# Altium schematic sheet ECU_Dummy.SchDoc
size A4; SheetNumber: 1; SheetTotal: 1
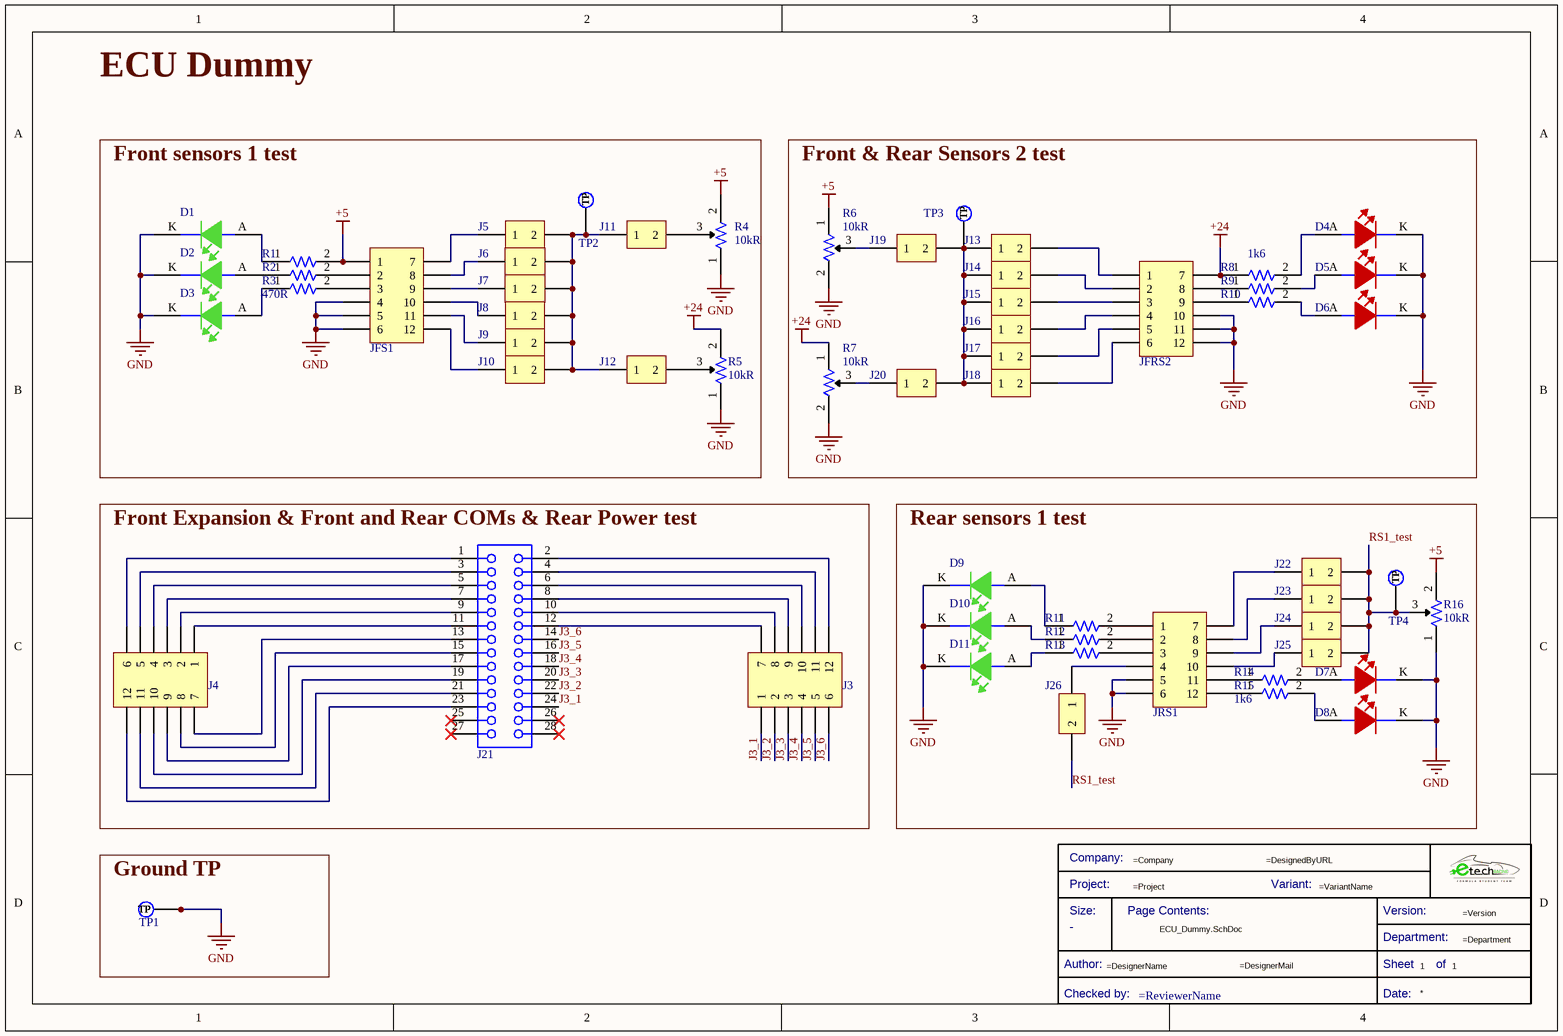
[diagram p0: ECU_Dummy.SchDoc]

## Parts
*  Title Block_template  (value not drawn)  (graphical)
D1  150080GS75000  [LED_0805_WE]  (value not drawn)
D2  150080GS75000  [LED_0805_WE]  (value not drawn)
D3  150080GS75000  [LED_0805_WE]  (value not drawn)
D4  150080RS75000  [LED_0805_WE]  (value not drawn)
D5  150080RS75000  [LED_0805_WE]  (value not drawn)
D6  150080RS75000  [LED_0805_WE]  (value not drawn)
D7  150080RS75000  [LED_0805_WE]  (value not drawn)
D8  150080RS75000  [LED_0805_WE]  (value not drawn)
D9  150080GS75000  [LED_0805_WE]  (value not drawn)
D10  150080GS75000  [LED_0805_WE]  (value not drawn)
D11  150080GS75000  [LED_0805_WE]  (value not drawn)
J3  1053101112  [J_NanoFit_2x6_V]  (value not drawn)
J4  1053101112  [J_NanoFit_2x6_V]  (value not drawn)
J5  2 Pin Header  [J_Pinheader_1x2]  (value not drawn)
J6  2 Pin Header  [J_Pinheader_1x2]  (value not drawn)
J7  2 Pin Header  [J_Pinheader_1x2]  (value not drawn)
J8  2 Pin Header  [J_Pinheader_1x2]  (value not drawn)
J9  2 Pin Header  [J_Pinheader_1x2]  (value not drawn)
J10  2 Pin Header  [J_Pinheader_1x2]  (value not drawn)
J11  2 Pin Header  [J_Pinheader_1x2]  (value not drawn)
J12  2 Pin Header  [J_Pinheader_1x2]  (value not drawn)
J13  2 Pin Header  [J_Pinheader_1x2]  (value not drawn)
J14  2 Pin Header  [J_Pinheader_1x2]  (value not drawn)
J15  2 Pin Header  [J_Pinheader_1x2]  (value not drawn)
J16  2 Pin Header  [J_Pinheader_1x2]  (value not drawn)
J17  2 Pin Header  [J_Pinheader_1x2]  (value not drawn)
J18  2 Pin Header  [J_Pinheader_1x2]  (value not drawn)
J19  2 Pin Header  [J_Pinheader_1x2]  (value not drawn)
J20  2 Pin Header  [J_Pinheader_1x2]  (value not drawn)
J21  61002821821  [61002821821]  (value not drawn)
J22  2 Pin Header  [J_Pinheader_1x2]  (value not drawn)
J23  2 Pin Header  [J_Pinheader_1x2]  (value not drawn)
J24  2 Pin Header  [J_Pinheader_1x2]  (value not drawn)
J25  2 Pin Header  [J_Pinheader_1x2]  (value not drawn)
J26  2 Pin Header  [J_Pinheader_1x2]  (value not drawn)
JFRS2  1053101112  [J_NanoFit_2x6_V]  (value not drawn)
JFS1  1053101112  [J_NanoFit_2x6_V]  (value not drawn)
JRS1  1053101112  [J_NanoFit_2x6_V]  (value not drawn)
R1  CR0805-FX-4700GLF  [R0805FTK]  (value not drawn)
R2  CR0805-FX-4700GLF  [R0805FTK]  (value not drawn)
R3  CR0805-FX-4700GLF  [R0805FTK]  (value not drawn)
R4  Resistance: 10kR  [R10k-VTR]  (hidden comment: 3296W-1-103LF)
R5  Resistance: 10kR  [R10k-VTR]  (hidden comment: 3296W-1-103LF)
R6  Resistance: 10kR  [R10k-VTR]  (hidden comment: 3296W-1-103LF)
R7  Resistance: 10kR  [R10k-VTR]  (hidden comment: 3296W-1-103LF)
R8  CR1206-FX-2201ELF  [R1206FTK-W]  (value not drawn)
R9  CR1206-FX-2201ELF  [R1206FTK-W]  (value not drawn)
R10  CR1206-FX-2201ELF  [R1206FTK-W]  (value not drawn)
R11  CR0805-FX-4700GLF  [R0805FTK]  (value not drawn)
R12  CR0805-FX-4700GLF  [R0805FTK]  (value not drawn)
R13  CR0805-FX-4700GLF  [R0805FTK]  (value not drawn)
R14  CR1206-FX-2201ELF  [R1206FTK-W]  (value not drawn)
R15  CR1206-FX-2201ELF  [R1206FTK-W]  (value not drawn)
R16  Resistance: 10kR  [R10k-VTR]  (hidden comment: 3296W-1-103LF)
TP1  Test Point  [TESTPOINT_WIDE]  (value not drawn)
TP2  TestPoint  [TestPoint]  (value not drawn)  (no BOM)
TP3  TestPoint  [TestPoint]  (value not drawn)  (no BOM)
TP4  TestPoint  [TestPoint]  (value not drawn)  (no BOM)

## Blocks framed on the sheet
Front sensors 1 test: D1-D3 J5-J12 JFS1 R1-R5 TP2
Front & Rear Sensors 2 test: D4-D6 J13-J20 JFRS2 R6-R10 TP3
Front Expansion & Front and Rear COMs & Rear Power test: J3 J4 J21
Rear sensors 1 test: D7-D11 J22-J26 JRS1 R11-R16 TP4
Ground TP: TP1

## Nets
+5: JFS1.1 R1.2 R4.2 R6.1 R16.2
+24: JFRS2.7 R5.2 R7.1 R8.1
GND: D1.K D2.K D3.K D4.K D5.K D6.K D7.K D8.K D9.K D10.K D11.K JFRS2.10 JFRS2.11 JFRS2.12 JFS1.4 JFS1.5 JFS1.6 JRS1.5 JRS1.6 R4.1 R5.1 R6.2 R7.2 R16.1 TP1.1(TP)
J3_1: J3.1 J21.24
J3_2: J3.2 J21.22
J3_3: J3.3 J21.20
J3_4: J3.4 J21.18
J3_5: J3.5 J21.16
J3_6: J3.6 J21.14
RS1_test: J22.2 J23.2 J24.2 J25.2 J26.2 R16.3 TP4.1(TP)
NetD1_A: D1.A R1.1
NetD2_A: D2.A R2.1
NetD3_A: D3.A R3.1
NetD4_A: D4.A R8.2
NetD5_A: D5.A R9.2
NetD6_A: D6.A R10.2
NetD7_A: D7.A R14.2
NetD8_A: D8.A R15.2
NetD9_A: D9.A R11.1
NetD10_A: D10.A R12.1
NetD11_A: D11.A R13.1
NetJ3_7: J3.7 J21.12
NetJ3_8: J3.8 J21.10
NetJ3_9: J3.9 J21.8
NetJ3_10: J3.10 J21.6
NetJ3_11: J3.11 J21.4
NetJ3_12: J3.12 J21.2
NetJ4_1: J4.1 J21.11
NetJ4_2: J4.2 J21.9
NetJ4_3: J4.3 J21.7
NetJ4_4: J4.4 J21.5
NetJ4_5: J4.5 J21.3
NetJ4_6: J4.6 J21.1
NetJ4_7: J4.7 J21.13
NetJ4_8: J4.8 J21.15
NetJ4_9: J4.9 J21.17
NetJ4_10: J4.10 J21.19
NetJ4_11: J4.11 J21.21
NetJ4_12: J4.12 J21.23
NetJ5_1: J5.1 JFS1.7
NetJ5_2: J5.2 J6.2 J7.2 J8.2 J9.2 J10.2 J11.1 J12.1 TP2.1(TP)
NetJ6_1: J6.1 JFS1.8
NetJ7_1: J7.1 JFS1.9
NetJ8_1: J8.1 JFS1.10
NetJ9_1: J9.1 JFS1.11
NetJ10_1: J10.1 JFS1.12
NetJ11_2: J11.2 R4.3
NetJ12_2: J12.2 R5.3
NetJ13_1: J13.1 J14.1 J15.1 J16.1 J17.1 J18.1 J19.2 J20.2 TP3.1(TP)
NetJ13_2: J13.2 JFRS2.1
NetJ14_2: J14.2 JFRS2.2
NetJ15_2: J15.2 JFRS2.3
NetJ16_2: J16.2 JFRS2.4
NetJ17_2: J17.2 JFRS2.5
NetJ18_2: J18.2 JFRS2.6
NetJ19_1: J19.1 R6.3
NetJ20_1: J20.1 R7.3
NetJ22_1: J22.1 JRS1.7
NetJ23_1: J23.1 JRS1.8
NetJ24_1: J24.1 JRS1.9
NetJ25_1: J25.1 JRS1.10
NetJ26_1: J26.1 JRS1.4
NetJFRS2_8: JFRS2.8 R9.1
NetJFRS2_9: JFRS2.9 R10.1
NetJFS1_2: JFS1.2 R2.2
NetJFS1_3: JFS1.3 R3.2
NetJRS1_1: JRS1.1 R11.2
NetJRS1_2: JRS1.2 R12.2
NetJRS1_3: JRS1.3 R13.2
NetJRS1_11: JRS1.11 R14.1
NetJRS1_12: JRS1.12 R15.1

Not connected (* = marked no-connect by the designer): J21 25* 26* 27* 28*

## Notes on the sheet
- ECU Dummy
- (near R3) 470R
- (near R8) 1k6
- 1k6
- (in symbol Title Block_template) Company:; Project:; Variant:; Size:; Page Contents:; Version:; Department:; Author:; Sheet; of; Checked by:; Date:

## Library data of the parts
* = Title Block_template: Standard Title Block; .Creator: GP; Category: Title Block; .PCBcheck: GP; .SCHcheck: GP; Checked by:: =ReviewerName; Size: -
D1-D3 D9-D11 = LEDGS-0805-450: Led, Green, 520 Nm, 3.2 V, 30 Ma, 450 Mcd Rohs Compliant: Yes; Manufacturer 1: Wurth Electronics; Viewing Angle: 140°; Lens Style: Clear,Rectangular; Luminous Intensity: 450mcd; Forward Voltage: 3.2V; Wavelength: 520nm; Forward Current: 30mA; Test Current: 20mA; .Creator: GP; ComponentLink1Description: Datasheet; ComponentLink1URL: https://www.we-online.com/catalog/datasheet/150080GS75000.pdf; ComponentLink2Description: Where buy it; ComponentLink2URL: https://katalog.we-online.de/en/led/WL-SMCW/150080GS75000; Supplier 1: RSComponents; Manufacturer Part Number 1: 150080GS75000; RoHS: Yes; Category: LEDs; Stock 1: 4350; Pricing 1: 50=0,19300, 500=0,12900, 1000=0,12300, 2000=0,11700, 4000=0,11100 (USD); Mount: Surface Mount; Case/Package: 0805; Case Code (Metric): 2012; Case Code (Imperial): 0805; Min Operating Temperature: -40°C; Max Operating Temperature: 85°C; Package Quantity: 4000; Packaging: Cut Tape; Dominant Wavelength: 520nm; Length: 2mm; Width: 1.25mm; Height: 0.7mm; REACH SVHC: Unknown; RoHS Compliant: Yes; ComponentLink3URL: https://datasheet.ciiva.com/29563/150080gs75000-29563008.pdf?src-supplier=Digi-Key; ComponentLink3Description: https://datasheet.ciiva.com/29563/150080gs75000-29563008.pdf?src-supplier=Digi-Key; ComponentLink4URL: https://datasheet.ciiva.com/29279/759434-da-01-en-chipled-0805-w-kl-gruen-150080gs75000-29279039.pdf?src-supplier=Conrad; ComponentLink4Description: https://datasheet.ciiva.com/29279/759434-da-01-en-chipled-0805-w-kl-gruen-150080gs75000-29279039.pdf?src-supplier=Conrad; Supplier Part Number 1: 8154221; Color: Green
D4-D8 = LEDRS-0805-150: 0805(H=0.8mm) 红色 高亮 λD=625nm VF=2V IF=30mA PD=72mW; Manufacturer 1: Wurth Electronics; Luminous Intensity: 150mcd; Viewing Angle: 140°; Forward Voltage: 2V; Wavelength: 625nm; Lens Style: Clear,Rectangular; Forward Current: 30mA; Test Current: 20mA; .Creator: DR; Color: Red; ComponentLink1Description: Datasheet; ComponentLink1URL: https://www.we-online.com/catalog/datasheet/150080RS75000.pdf; ComponentLink2Description: Where buy it; ComponentLink2URL: https://katalog.we-online.de/en/led/WL-SMCW/150080RS75000; Supplier 1: RSComponents; Manufacturer Part Number 1: 150080RS75000; RoHS: Yes; Category: LEDs; Stock 1: 1; Pricing 1: 50=0,19300, 500=0,12900, 1000=0,12300, 2000=0,11700, 4000=0,11100 (USD); Mount: Surface Mount; Case/Package: 0805; Case Code (Metric): 2012; Case Code (Imperial): 0805; Min Operating Temperature: -40°C; Max Operating Temperature: 85°C; Package Quantity: 4000; Packaging: Tape and Reel; Dominant Wavelength: 625nm; Length: 2mm; Width: 1.25mm; Height: 0.7mm; REACH SVHC: Unknown; RoHS Compliant: Yes; ComponentLink3URL: https://datasheet.ciiva.com/22656/150080rs75000-22656961.pdf?src-supplier=Element14; ComponentLink3Description: https://datasheet.ciiva.com/22656/150080rs75000-22656961.pdf?src-supplier=Element14; ComponentLink4URL: https://datasheet.ciiva.com/29279/759435-da-01-en-chipled-0805-w-kl-rot-150080rs75000-29279032.pdf?src-supplier=Conrad; ComponentLink4Description: https://datasheet.ciiva.com/29279/759435-da-01-en-chipled-0805-w-kl-rot-150080rs75000-29279032.pdf?src-supplier=Conrad; Supplier Part Number 1: 8154225P
J3 J4 JFRS2 JFS1 JRS1 = J_NanoFit_2x6_V: Nano-Fit Vertical Header, Through Hole, 2.50mm Pitch, Dual Row, 12 Circuits, with Kinked Pins, Tin (Sn) Plating, Black, Glow-Wire Capable, Tray
J5-J20 J22-J26 = J_Jumper_H
J21 = 61002821821: WR-PHD Socket Header, SMT, Vertical, pitch 2.54mm, 2 Row, 28P; Manufacturer: Wurth Elektronik; Contact Resistance: 20mΩ; Rated Current: 3A; Working Voltage: 250V; Withstanding Voltage: 600V; ComponentLink1Description: Website Link; ComponentLink1URL: https://www.we-online.com/redexpert/article/61002821821?ad; ComponentLink2Description: Datasheet Link; ComponentLink2URL: https://www.we-online.com/redexpert/spec/61002821821?ad; Manufacturer Part Number: 61002821821; Category: Board-to-Board Connectors; Match Code: WR-PHD; Mount: Surface Mount; Operating Temperature Max: 105°C; Operating Temperature Min: -40°C; Packaging: Tube; Gender: Socket Header; Number of Pins: 28; Number of Rows: 2; Orientation: Vertical; Pitch: 2.54mm
R1-R3 R11-R13 = R470-0805FTK: Res Thick Film 0805 470 Ohm 1% 1/8W ±100ppm/°C Molded SMD SMD Paper Tape on Plastic Reel; Manufacturer 1: Bourns; Power Rating: 125mW; Voltage Rating: 150V; .Creator: DR; Resistance: 470R; Supplier 1: Arrow Electronics; Manufacturer Part Number 1: CR0805-FX-4700GLF; RoHS: Yes; Category: Chip SMD Resistors; Stock 1: 12623; Pricing 1: 1=0,00990, 10=0,00980, 25=0,00950, 50=0,00940, 100=0,00930, 250=0,00920, 500=0,00910, 1000=0,00890, 3000=0,00870, 6000=0,00860 (USD); Mount: Surface Mount; Case/Package: 0805; Number of Pins: 2; Case Code (Imperial): 0805; Case Code (Metric): 2012; Contact Plating: Tin; Min Operating Temperature: -55°C; Max Operating Temperature: 155°C; Packaging: Tape and Reel; Tolerance: 1%; Resistor Type: Thick Film; Termination: SMD/SMT; Temperature Coefficient: 100ppm/°C; Voltage Rating (DC): 150V; Features: Moisture Resistant; Series: CR0805; Max Power Dissipation: 125mW; Number of Terminations: 2; Resistance Tolerance: 1%; Construction: Rectangular; Technology: THICK FILM; Length: 2mm; Height: 0.5mm; Depth: 1.25mm; Thickness: 508um; Radiation Hardening: No; REACH SVHC: No SVHC; Military Standard: Not; ComponentLink1URL: https://datasheet.ciiva.com/11808/0900766b80fcdb72-11808686.pdf?src-supplier=RSComponents; ComponentLink1Description: https://datasheet.ciiva.com/11808/0900766b80fcdb72-11808686.pdf?src-supplier=RSComponents; ComponentLink2URL: https://datasheet.ciiva.com/7985/1856384-7985880.pdf?src-supplier=Element14; ComponentLink2Description: https://datasheet.ciiva.com/7985/1856384-7985880.pdf?src-supplier=Element14; ComponentLink3URL: https://datasheet.ciiva.com/22693/1902866-22693247.pdf?src-supplier=Element14; ComponentLink3Description: https://datasheet.ciiva.com/22693/1902866-22693247.pdf?src-supplier=Element14; ComponentLink4URL: https://datasheet.ciiva.com/5541/chpreztr-5541930.pdf?src-supplier=Mouser; ComponentLink4Description: https://datasheet.ciiva.com/5541/chpreztr-5541930.pdf?src-supplier=Mouser; Supplier Part Number 1: CR0805-FX-4700GLF
R4-R7 R16 = R10k-VTR: Trimmer, Cermet, Rest 10 Kilohms, PCB, 25 Turns, Pwr-Rtg 0.5W, 3296 Series; Manufacturer: Bourns; Tolerance: 10%; Power Rating: 500mW; Number of Turns: 25; Temperature Coefficient: 100ppm/°C; Insulation Resistance: 1GR; .Creator: DO; Supplier 1: RSComponents; Manufacturer Part Number: 3296W-1-103LF; RoHS: Yes; Category: Variable Resistors and Potentiometers; Stock 1: 3300; Pricing 1: 50=2,54800, 100=2,31900, 200=2,14000, 300=1,88400, 500=1,55300 (USD); Mount: PCB,Through Hole; Weight: 0.03oz; Color: Blue; Contact Plating: Tin,Matte; Min Operating Temperature: -55°C; Max Operating Temperature: 125°C; Packaging: Rail/Tube; Package Quantity: 50; Termination: Pin; Resistor Type: Cermet; Technology: CERMET; Taper: Linear; Max Power Dissipation: 500mW; Series: 3296; Resistance Tolerance: 10%; Length: 9.53mm; Width: 9.53mm; Height: 0.395inch; Depth: 4.83mm; Radiation Hardening: No; REACH SVHC: No SVHC; Military Standard: Not; Lead Free: Lead Free; RoHS Compliant: Yes; ComponentLink1URL: https://datasheet.ciiva.com/19454/853572-19454866.pdf?src-supplier=Jameco; ComponentLink1Description: https://datasheet.ciiva.com/19454/853572-19454866.pdf?src-supplier=Jameco; ComponentLink2URL: https://datasheet.ciiva.com/11830/0900766b8069ccf4-11830871.pdf?src-supplier=RSComponents; ComponentLink2Description: https://datasheet.ciiva.com/11830/0900766b8069ccf4-11830871.pdf?src-supplier=RSComponents; ComponentLink3URL: https://datasheet.ciiva.com/29122/447277-da-01-en-trimmer-tht3296w-1-103lf-10k-0-5w-29122362.pdf?src-supplier=Conrad; ComponentLink3Description: https://datasheet.ciiva.com/29122/447277-da-01-en-trimmer-tht3296w-1-103lf-10k-0-5w-29122362.pdf?src-supplier=Conrad; ComponentLink4URL: https://datasheet.ciiva.com/26913/3296w-1-103lf-26913885.pdf?src-supplier=IIIC; ComponentLink4Description: https://datasheet.ciiva.com/26913/3296w-1-103lf-26913885.pdf?src-supplier=IIIC; ComponentLink5URL: https://datasheet.ciiva.com/1131/1815117-1131273.pdf?src-supplier=Element14; ComponentLink5Description: https://datasheet.ciiva.com/1131/1815117-1131273.pdf?src-supplier=Element14; ComponentLink6URL: https://datasheet.ciiva.com/18411/70153578-18411561.pdf?src-supplier=Allied+Electronics; ComponentLink6Description: https://datasheet.ciiva.com/18411/70153578-18411561.pdf?src-supplier=Allied+Electronics; ComponentLink7URL: https://datasheet.ciiva.com/3266/3296-3266187.pdf?src-supplier=Avnet; ComponentLink7Description: https://datasheet.ciiva.com/3266/3296-3266187.pdf?src-supplier=Avnet; ComponentLink8URL: https://datasheet.ciiva.com/30093/3296-30093899.pdf?src-supplier=Onlinecomponents.com; ComponentLink8Description: https://datasheet.ciiva.com/30093/3296-30093899.pdf?src-supplier=Onlinecomponents.com; ComponentLink9URL: https://datasheet.ciiva.com/2156/3296-2156893.pdf?src-supplier=Digi-Key; ComponentLink9Description: https://datasheet.ciiva.com/2156/3296-2156893.pdf?src-supplier=Digi-Key; ComponentLink10URL: https://datasheet.ciiva.com/14173/ew3296-dat-e-14173022.pdf?src-supplier=Distrelec; ComponentLink10Description: https://datasheet.ciiva.com/14173/ew3296-dat-e-14173022.pdf?src-supplier=Distrelec; Supplier Part Number 1: 1673377; ComponentLink11Description: Where buy it; ComponentLink11URL: https://es.rs-online.com/web/p/potenciometros-de-ajuste/5219647
R8-R10 R14 R15 = R2.2K-1206FTK: Res Thick Film 1206 2.2K Ohm 1% 1/4W ±100ppm/°C Molded SMD SMD Paper Tape on Plastic Reel; Manufacturer 1: Bourns; Power Rating: 250mW; Voltage Rating: 200V; .Creator: AC; Resistance: 2.2kR; Supplier 1: Digi-Key; Manufacturer Part Number 1: CR1206-FX-2201ELF; RoHS: Yes; Category: Chip SMD Resistors; Stock 1: 150; Pricing 1: 1=0,10000, 10=0,04200, 100=0,01700, 1000=0,00762, 2500=0,00661 (USD); Mount: Surface Mount; Case/Package: 1206; Number of Pins: 2; Contact Plating: Tin; Case Code (Metric): 3216; Case Code (Imperial): 1206; Min Operating Temperature: -55°C; Max Operating Temperature: 155°C; Tolerance: 1%; Resistor Type: Thick Film; Temperature Coefficient: 100ppm/°C; Packaging: Tape and Reel; Package Quantity: 5000; Number of Terminations: 2; Termination: SMD/SMT; Max Power Dissipation: 250mW; Voltage Rating (DC): 200V; Features: Moisture Resistant; Series: CR1206; Resistance Tolerance: 1%; Construction: Rectangular; Technology: THICK FILM; Length: 3.2mm; Width: 1.6mm; Height: 0.6mm; Depth: 1.6mm; Thickness: 610um; Radiation Hardening: No; REACH SVHC: No SVHC; Military Standard: Not; RoHS Compliant: Yes; ComponentLink1URL: https://datasheet.ciiva.com/11809/0900766b80fcdb72-11809898.pdf?src-supplier=RSComponents; ComponentLink1Description: https://datasheet.ciiva.com/11809/0900766b80fcdb72-11809898.pdf?src-supplier=RSComponents; ComponentLink2URL: https://datasheet.ciiva.com/9123/chpreztr-9123227.pdf?src-supplier=Avnet; ComponentLink2Description: https://datasheet.ciiva.com/9123/chpreztr-9123227.pdf?src-supplier=Avnet; ComponentLink3URL: https://datasheet.ciiva.com/16770/70154685-16770447.pdf?src-supplier=Allied+Electronics; ComponentLink3Description: https://datasheet.ciiva.com/16770/70154685-16770447.pdf?src-supplier=Allied+Electronics; ComponentLink4URL: https://datasheet.ciiva.com/7985/1856384-7985879.pdf?src-supplier=Element14; ComponentLink4Description: https://datasheet.ciiva.com/7985/1856384-7985879.pdf?src-supplier=Element14; ComponentLink5URL: https://datasheet.ciiva.com/22693/1902866-22693258.pdf?src-supplier=Element14; ComponentLink5Description: https://datasheet.ciiva.com/22693/1902866-22693258.pdf?src-supplier=Element14; Supplier Part Number 1: CR1206-FX-2201ELFCT-ND; ComponentLink6Description: RS; ComponentLink6URL: https://es.rs-online.com/web/p/resistencias-fijas-para-montaje-en-superficie/7409097/
TP1 = TestPoint_Wide: TestPoint 5x5mm
TP2-TP4 = TestPoint: Test Point 1x1 mm; .Creator: GP; Category: TestPoint; .PCBcheck: GP; .SCHcheck: GP